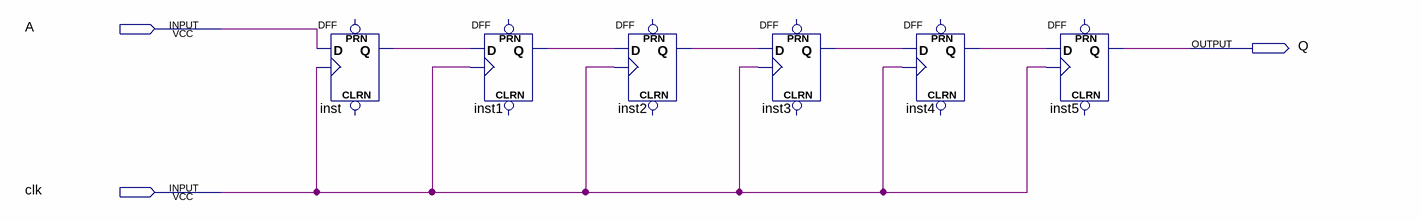
[diagram p0: schematic sheet]
// Quartus schematic askisi2.bdf as structural Verilog: 6 symbols, 3 pins
module askisi2 (
  input  A,
  input  clk,
  output Q
);

  wire inst1_q, inst2_q, inst3_q, inst4_q, inst_q;

  DFF inst (.CLK(clk), .D(A), .Q(inst_q));  // open: CLRN, PRN
  DFF inst1 (.CLK(clk), .D(inst_q), .Q(inst1_q));  // open: CLRN, PRN
  DFF inst2 (.CLK(clk), .D(inst1_q), .Q(inst2_q));  // open: CLRN, PRN
  DFF inst3 (.CLK(clk), .D(inst2_q), .Q(inst3_q));  // open: CLRN, PRN
  DFF inst4 (.CLK(clk), .D(inst3_q), .Q(inst4_q));  // open: CLRN, PRN
  DFF inst5 (.CLK(clk), .D(inst4_q), .Q(Q));  // open: CLRN, PRN
endmodule
